# EAGLE design M133X (EAGLE 6.6.0)
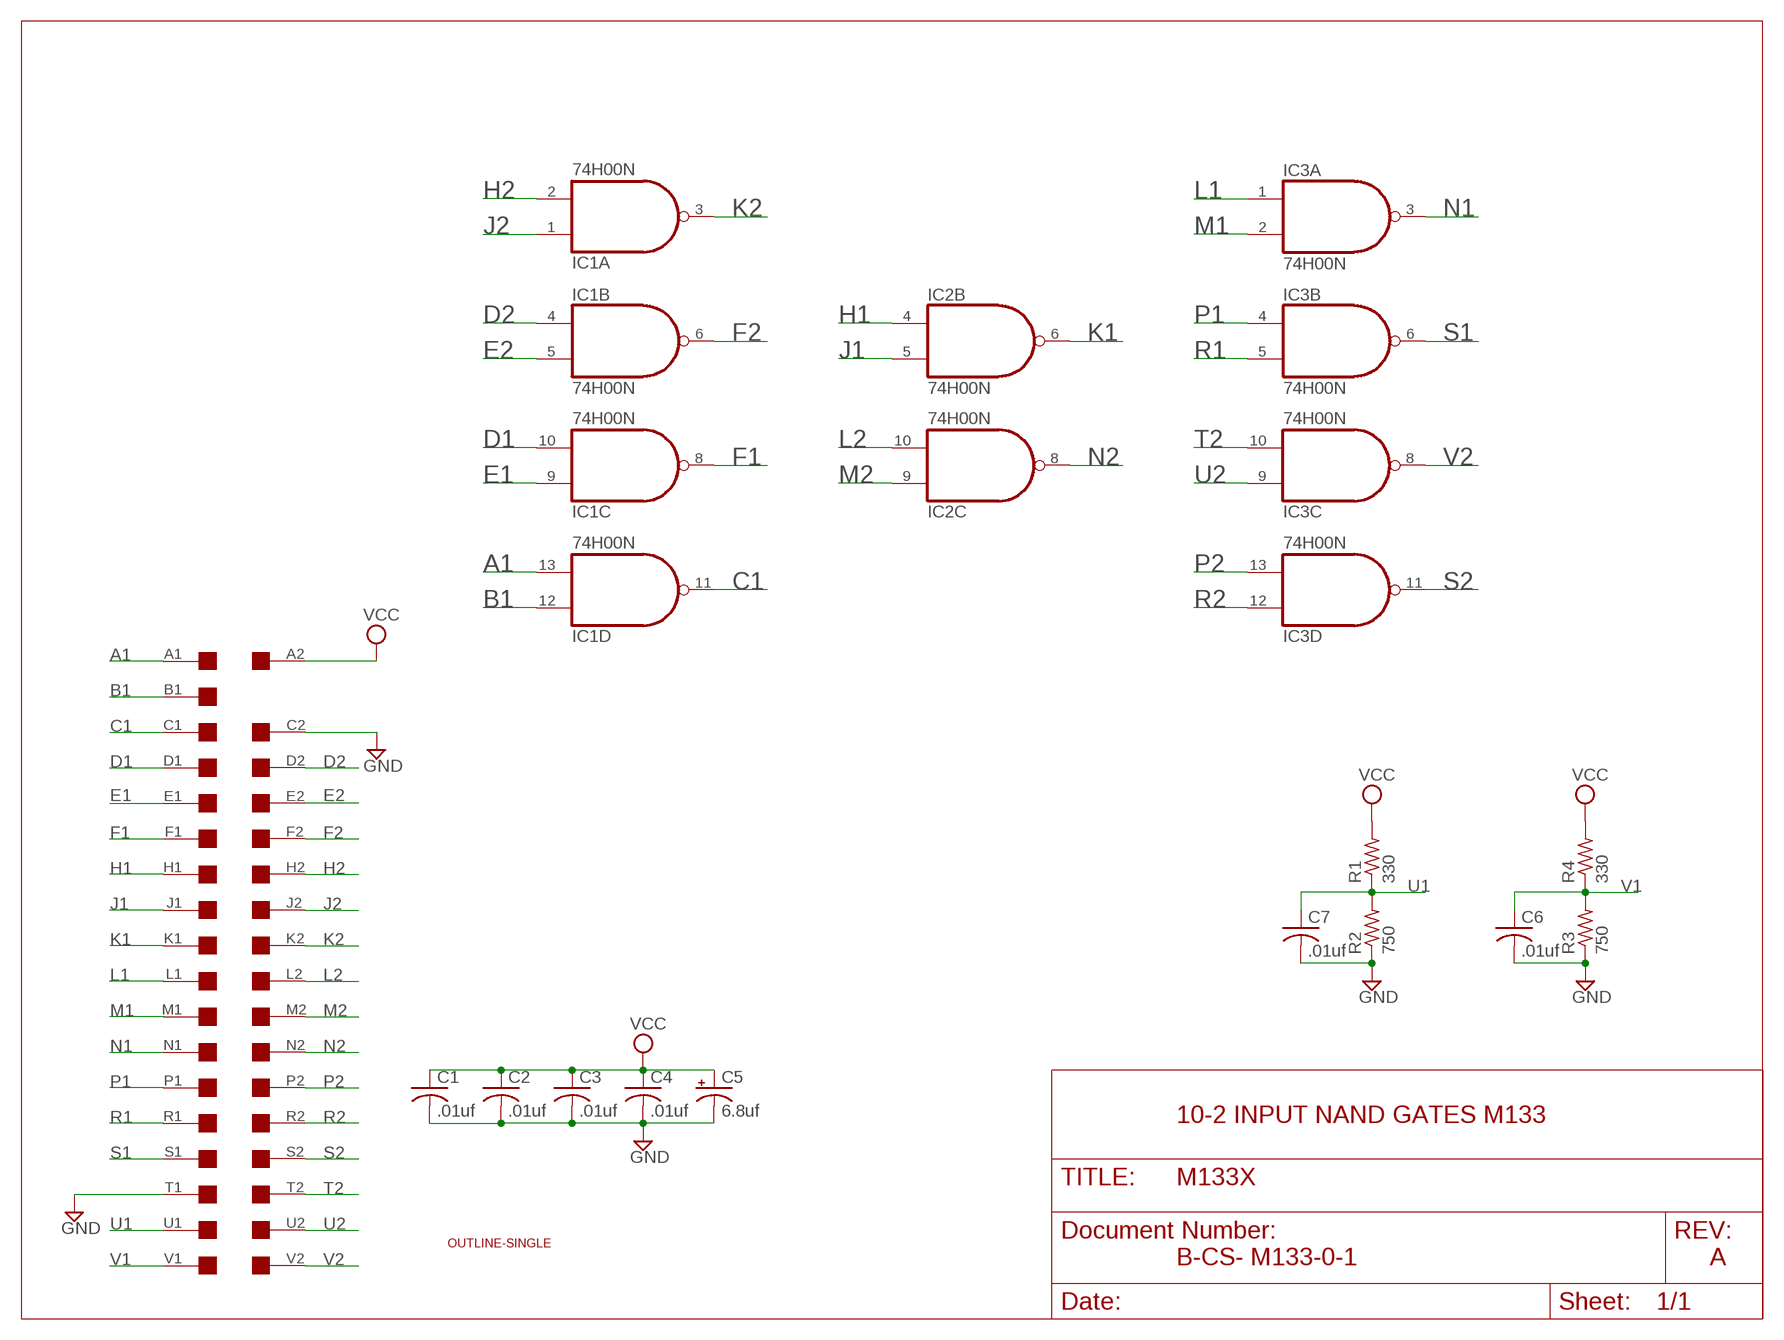
[diagram p0: schematic, sheet 1]

## Parts
C1  .01uf  C-US050-025X075  [C050-025X075]
C2  .01uf  C-US050-025X075  [C050-025X075]
C3  .01uf  C-US050-025X075  [C050-025X075]
C4  .01uf  C-US050-025X075  [C050-025X075]
C5  6.8uf  CPOL-USE15-5AXIAL  [E15-5]
C6  .01uf  C-US050-025X075  [C050-025X075]
C7  .01uf  C-US050-025X075  [C050-025X075]
IC1  74H00N  7400N  [DIL14]
IC2  74H00N  7400N  [DIL14]
IC3  74H00N  7400N  [DIL14]
R1  330  R-US_0207/10  [0207/10]
R2  750  R-US_0207/10  [0207/10]
R3  750  R-US_0207/10  [0207/10]
R4  330  R-US_0207/10  [0207/10]
U$1  OUTLINE-SINGLE  [SINGLE]
U$4  SINGLE  [EDGE-CON2]

## Nets
A1: IC1.13(D:I1) U$4.A1
B1: IC1.12(D:I0) U$4.B1
C1: IC1.11(D:O) U$4.C1
D1: IC1.10(C:I1) U$4.D1
D2: IC1.4(B:I0) U$4.D2
E1: IC1.9(C:I0) U$4.E1
E2: IC1.5(B:I1) U$4.E2
F1: IC1.8(C:O) U$4.F1
F2: IC1.6(B:O) U$4.F2
GND [Supply]: C1.2 C2.2 C3.2 C4.2 C5.- C6.2 C7.2 R2.1 R3.1 U$4.C2 U$4.T1
H1: IC2.4(B:I0) U$4.H1
H2: IC1.2(A:I1) U$4.H2
J1: IC2.5(B:I1) U$4.J1
J2: IC1.1(A:I0) U$4.J2
K1: IC2.6(B:O) U$4.K1
K2: IC1.3(A:O) U$4.K2
L1: IC3.1(A:I0) U$4.L1
L2: IC2.10(C:I1) U$4.L2
M1: IC3.2(A:I1) U$4.M1
M2: IC2.9(C:I0) U$4.M2
N1: IC3.3(A:O) U$4.N1
N2: IC2.8(C:O) U$4.N2
P1: IC3.4(B:I0) U$4.P1
P2: IC3.13(D:I1) U$4.P2
R1: IC3.5(B:I1) U$4.R1
R2: IC3.12(D:I0) U$4.R2
S1: IC3.6(B:O) U$4.S1
S2: IC3.11(D:O) U$4.S2
T2: IC3.10(C:I1) U$4.T2
U1: C7.1 R1.1 R2.2 U$4.U1
U2: IC3.9(C:I0) U$4.U2
V1: C6.1 R3.2 R4.1 U$4.V1
V2: IC3.8(C:O) U$4.V2
VCC [Supply]: C1.1 C2.1 C3.1 C4.1 C5.+ R1.2 R4.2 U$4.A2
Unconnected: IC2.1(A:I0) IC2.2(A:I1) IC2.3(A:O) IC2.11(D:O) IC2.12(D:I0) IC2.13(D:I1) U$4.B2

## Notes on the sheet
- 10-2 INPUT NAND GATES M133
- B-CS- M133-0-1 | A

## Power pins joined to a net without a drawn wire
GND: IC1.7(P:GND) IC2.7(P:GND) IC3.7(P:GND)
VCC: IC1.14(P:VCC) IC2.14(P:VCC) IC3.14(P:VCC)

## Library data of the parts
C1-C4 C6 C7 = rcl:C-US: CAPACITOR, American symbol
C5 = rcl:CPOL-US: POLARIZED CAPACITOR, American symbol
IC1-IC3 = 74xx-us:74*00: Quad 2-input NAND gate
R1-R4 = rcl:R-US_: RESISTOR, American symbol
U$1 = dec-con:OUTLINE-*: Board outlines for DEC boards.
U$4 = dec-con:SINGLE: Single-Height DEC board

## Net classes
1 Supply: width 0.813 mm

## Board
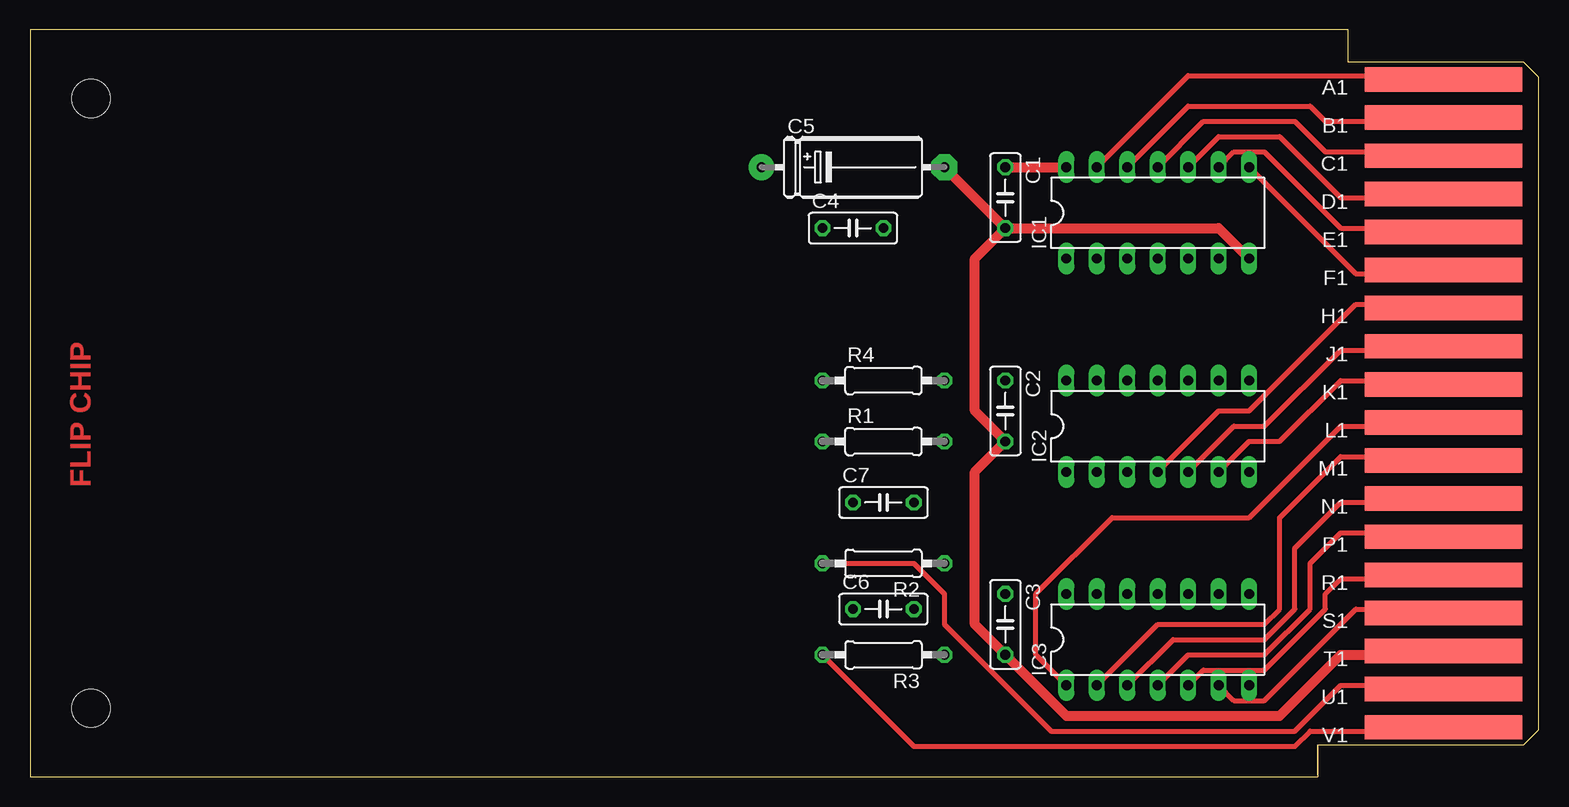
[diagram p1: board, top side]
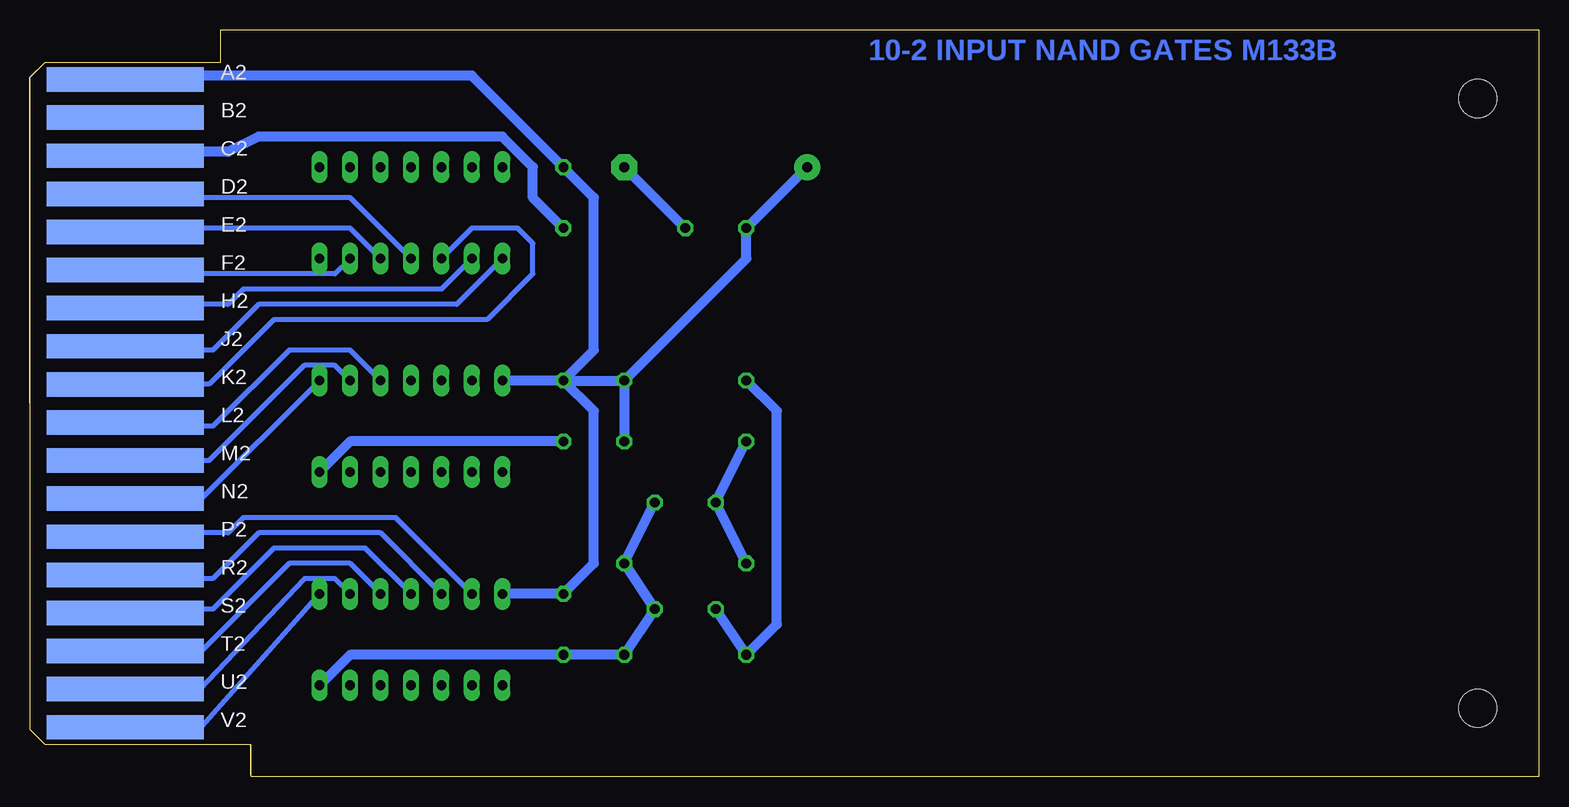
[diagram p2: board, bottom side, seen from below]

Size 125.73 x 62.23 mm. Coordinates in mm from the lower left corner, seen from the top.
Copper layers (1+16): Top 0.035mm / dielectric 1.5mm / Bottom 0.035mm
Design rules "16mils": minimum track width 16mil, minimum drill 32mil, track to track 15mil, track to pad 10mil, pad to pad 10mil, via to via 10mil, smd to smd 10mil, copper to edge 13mil, drill to drill 10mil, minimum pad ring 10mil, minimum via ring 8mil, stop-mask expansion 0mil, vias tented up to drill 0mil, thermal gap 10mil

### Footprints (pad centres in the part's own frame; a part is rotated, then mirrored left to right if it is on the bottom)
C050-025X075 = drill 0.813 octagon: 1 -2.54,0; 2 2.54,0
E15-5 = drill 0.813 pad 2.159: + -7.62,0 | drill 0.813 pad 2.159 octagon: - 7.62,0
DIL14 = drill 0.813 long: 1 -7.62,-3.81; 2 -5.08,-3.81; 3 -2.54,-3.81; 4 0,-3.81; 5 2.54,-3.81; 6 5.08,-3.81; 7 7.62,-3.81; 8 7.62,3.81; 9 5.08,3.81; 10 2.54,3.81; 11 0,3.81; 12 -2.54,3.81; 13 -5.08,3.81; 14 -7.62,3.81
0207/10 = drill 0.813 octagon: 1 -5.08,0; 2 5.08,0
SINGLE = hole 3.175: 120.65,56.515; 120.65,5.715
EDGE-CON2 = smd 13.106 x 2.032: A1 7.938,4.128; B1 7.938,7.303; C1 7.938,10.477; D1 7.938,13.652; E1 7.938,16.828; F1 7.938,20.003; H1 7.938,23.177; J1 7.938,26.352; K1 7.938,29.527; L1 7.938,32.703; M1 7.938,35.877; N1 7.938,39.053; P1 7.938,42.227; R1 7.938,45.403; S1 7.938,48.578; T1 7.938,51.752; U1 7.938,54.928; V1 7.938,58.102 | smd 13.106 x 2.032 bottom: A2 7.938,4.128; B2 7.938,7.303; C2 7.938,10.477; D2 7.938,13.652; E2 7.938,16.828; F2 7.938,20.003; H2 7.938,23.177; J2 7.938,26.352; K2 7.938,29.527; L2 7.938,32.703; M2 7.938,35.877; N2 7.938,39.053; P2 7.938,42.227; R2 7.938,45.403; S2 7.938,48.578; T2 7.938,51.752; U2 7.938,54.928; V2 7.938,58.102

### Placement (x,y rotation side)
C1  81.28,48.26 270 top
C2  81.28,30.48 270 top
C3  81.28,12.7 270 top
C4  68.58,45.72 0 top
C5  68.58,50.8 0 top
C6  71.12,13.97 0 top
C7  71.12,22.86 0 top
IC1  93.98,46.99 0 top
IC2  93.98,29.21 0 top
IC3  93.98,11.43 0 top
R1  71.12,27.94 0 top
R2  71.12,17.78 180 top
R3  71.12,10.16 180 top
R4  71.12,33.02 0 top
U$1  125.73,62.23 180 top
U$4  125.73,62.23 180 top

### Tracks (layer width: path | path; a pad name or v marks a point on that pad's centre or on a via)
A1
  Top 0.406: U$4.A1 117.7,58.42 96.52,58.42 IC1.13
B1
  Top 0.406: U$4.B1 117.8,54.61 107.95,54.61 106.68,55.88 96.52,55.88 IC1.12
C1
  Top 0.406: U$4.C1 117.77,52.07 107.95,52.07 105.41,54.61 97.79,54.61 IC1.11
D1
  Top 0.406: U$4.D1 117.79,48.26 109.22,48.26 104.14,53.34 99.06,53.34 IC1.10
D2
  Bottom 0.406: U$4.D2 112.06,48.56 111.76,48.26 99.06,48.26 IC1.4
E1
  Top 0.406: U$4.E1 117.76,45.72 109.22,45.72 102.87,52.07 100.33,52.07 IC1.9
E2
  Bottom 0.406: U$4.E2 112.09,45.39 111.76,45.72 99.06,45.72 IC1.5
F1
  Top 0.406: U$4.F1 111.76,42.19 111.76,41.91 110.49,41.91 IC1.8
F2
  Bottom 0.406: U$4.F2 112.04,42.19 111.76,41.91 100.33,41.91 IC1.6
GND
  Top 0.813: IC1.7 99.06,45.72 C1.2 | C1.2 C5.- | C1.2 78.74,43.18 78.74,30.48 C2.2 78.74,25.4 78.74,12.7 C3.2 86.36,5.08 104.14,5.08 109.22,10.16 117.76,10.16 U$4.T1
  Bottom 0.813: C5.- C4.2 | IC3.7 99.06,10.16 C3.2 R3.1 C6.2 R2.1 C7.2 | IC2.7 99.06,27.94 C2.2 | U$4.C2 111.76,52.07 109.22,52.07 106.68,53.34 86.36,53.34 83.82,50.8 83.82,48.26 C1.2
H1
  Top 0.406: U$4.H1 117.76,39.37 110.49,39.37 101.6,30.48 99.06,30.48 IC2.4
H2
  Bottom 0.406: U$4.H2 112.09,39.04 111.76,39.37 109.22,39.37 107.95,40.64 91.44,40.64 IC1.2
J1
  Top 0.406: U$4.J1 117.76,35.56 109.22,35.56 102.87,29.21 100.33,29.21 IC2.5
J2
  Bottom 0.406: U$4.J2 112.09,35.89 111.76,35.56 110.49,35.56 106.68,39.37 90.17,39.37 IC1.1
K1
  Top 0.406: U$4.K1 117.78,33.02 109.22,33.02 104.14,27.94 101.6,27.94 IC2.6
K2
  Bottom 0.406: U$4.K2 110.8,32.72 105.41,38.1 87.63,38.1 83.82,41.91 83.82,44.45 85.09,45.72 88.9,45.72 IC1.3
L1
  Top 0.406: IC3.1 83.82,10.16 83.82,15.24 90.17,21.59 101.6,21.59 109.22,29.21 117.76,29.21 U$4.L1
L2
  Bottom 0.406: U$4.L2 112.09,29.54 111.76,29.21 110.49,29.21 104.14,35.56 99.06,35.56 IC2.10
M1
  Top 0.406: IC3.2 93.98,12.7 102.87,12.7 104.14,13.97 104.14,21.59 109.22,26.67 117.76,26.67 U$4.M1
M2
  Bottom 0.406: U$4.M2 110.82,26.34 102.87,34.29 100.33,34.29 IC2.9
N1
  Top 0.406: IC3.3 95.25,11.43 102.87,11.43 105.41,13.97 105.41,19.05 109.22,22.86 117.76,22.86 U$4.N1
N2
  Bottom 0.406: U$4.N2 112.09,23.19 111.76,22.86 IC2.8
P1
  Top 0.406: IC3.4 96.52,10.16 102.87,10.16 106.68,13.97 106.68,17.78 109.22,20.32 117.76,20.32 U$4.P1
P2
  Bottom 0.406: U$4.P2 112.09,19.99 111.76,20.32 109.22,20.32 107.95,21.59 95.25,21.59 IC3.13
R1
  Top 0.406: IC3.5 97.79,8.89 102.87,8.89 107.95,13.97 107.95,15.24 109.22,16.51 117.76,16.51 U$4.R1
R2
  Bottom 0.406: U$4.R2 112.09,16.84 111.76,16.51 110.49,16.51 106.68,20.32 96.52,20.32 IC3.12
S1
  Top 0.406: U$4.S1 117.78,13.97 110.49,13.97 102.87,6.35 100.33,6.35 IC3.6
S2
  Bottom 0.406: U$4.S2 112.06,13.66 111.76,13.97 110.49,13.97 105.41,19.05 97.79,19.05 IC3.11
T2
  Bottom 0.406: U$4.T2 112.09,10.49 111.76,10.16 104.14,17.78 99.06,17.78 IC3.10
U1
  Top 0.406: U$4.U1 112.12,7.26 111.76,7.62 109.22,7.62 105.41,3.81 85.09,3.81 76.2,12.7 76.2,15.24 73.66,17.78 R2.2
  Bottom 0.813: R2.2 C7.1 R1.1
U2
  Bottom 0.406: U$4.U2 111.61,7.26 102.87,16.51 100.33,16.51 IC3.9
V1
  Top 0.406: U$4.V1 112.15,4.2 111.76,3.81 106.68,3.81 105.41,2.54 73.66,2.54 R3.2
  Bottom 0.813: C6.1 R3.2 63.5,12.7 63.5,30.48 R4.1
V2
  Bottom 0.406: U$4.V2 112.15,4.2 111.76,3.81 IC3.8
VCC
  Top 0.813: C1.1 IC1.14
  Bottom 0.813: U$4.A2 117.72,58.42 88.9,58.42 C1.1 78.74,48.26 78.74,35.56 C2.1 | C5.+ C4.1 66.04,43.18 R4.2 | R4.2 R1.2 | C2.1 R4.2 | C2.1 IC2.14 | C2.1 78.74,30.48 78.74,17.78 C3.1 IC3.14

### Text on the board
Top: FLIP CHIP
Bottom: 10-2 INPUT NAND GATES M133B